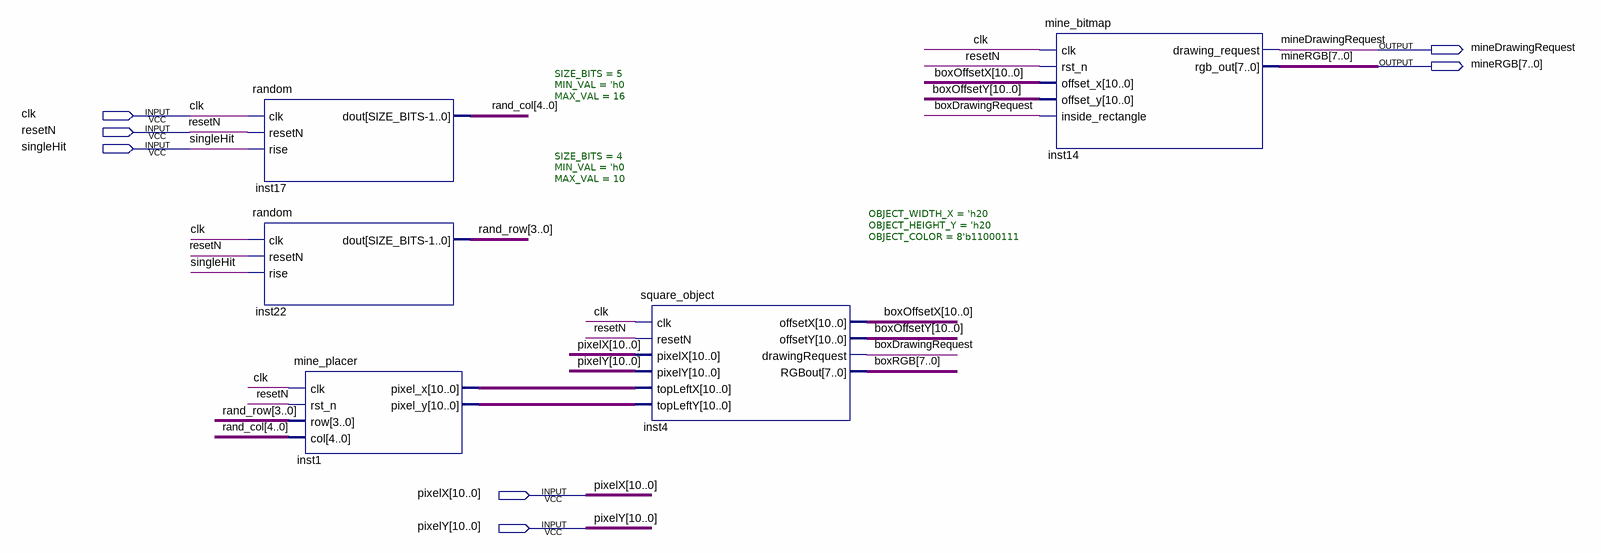
[diagram p0: schematic sheet]
// Quartus schematic mine_block.bdf as structural Verilog: 5 symbols, 7 pins
module mine_block (
  input  clk,
  input  resetN,
  input  singleHit,
  input  [10:0] pixelX,
  input  [10:0] pixelY,
  output mineDrawingRequest,
  output [7:0] mineRGB
);

  wire boxDrawingRequest;
  wire [3:0] rand_row;
  wire [4:0] rand_col;
  wire [7:0] boxRGB;
  wire [10:0] boxOffsetX, boxOffsetY, inst1_pixel_x, inst1_pixel_y;

  random #(.SIZE_BITS(5), .MIN_VAL('h0), .MAX_VAL(16)) inst17 (
    .clk(clk), .resetN(resetN), .rise(singleHit), .dout(rand_col));
  random #(.SIZE_BITS(4), .MIN_VAL('h0), .MAX_VAL(10)) inst22 (
    .clk(clk), .resetN(resetN), .rise(singleHit), .dout(rand_row));
  mine_placer inst1 (
    .clk(clk), .rst_n(resetN), .row(rand_row), .col(rand_col), .pixel_x(inst1_pixel_x),
    .pixel_y(inst1_pixel_y));
  square_object #(.OBJECT_WIDTH_X('h20), .OBJECT_HEIGHT_Y('h20), .OBJECT_COLOR(8'b11000111)) inst4 (
    .clk(clk), .resetN(resetN), .pixelX(pixelX), .pixelY(pixelY), .topLeftX(inst1_pixel_x),
    .topLeftY(inst1_pixel_y), .offsetX(boxOffsetX), .offsetY(boxOffsetY), .drawingRequest(boxDrawingRequest),
    .RGBout(boxRGB));
  mine_bitmap inst14 (
    .clk(clk), .rst_n(resetN), .offset_x(boxOffsetX), .offset_y(boxOffsetY),
    .inside_rectangle(boxDrawingRequest), .drawing_request(mineDrawingRequest), .rgb_out(mineRGB));
endmodule
